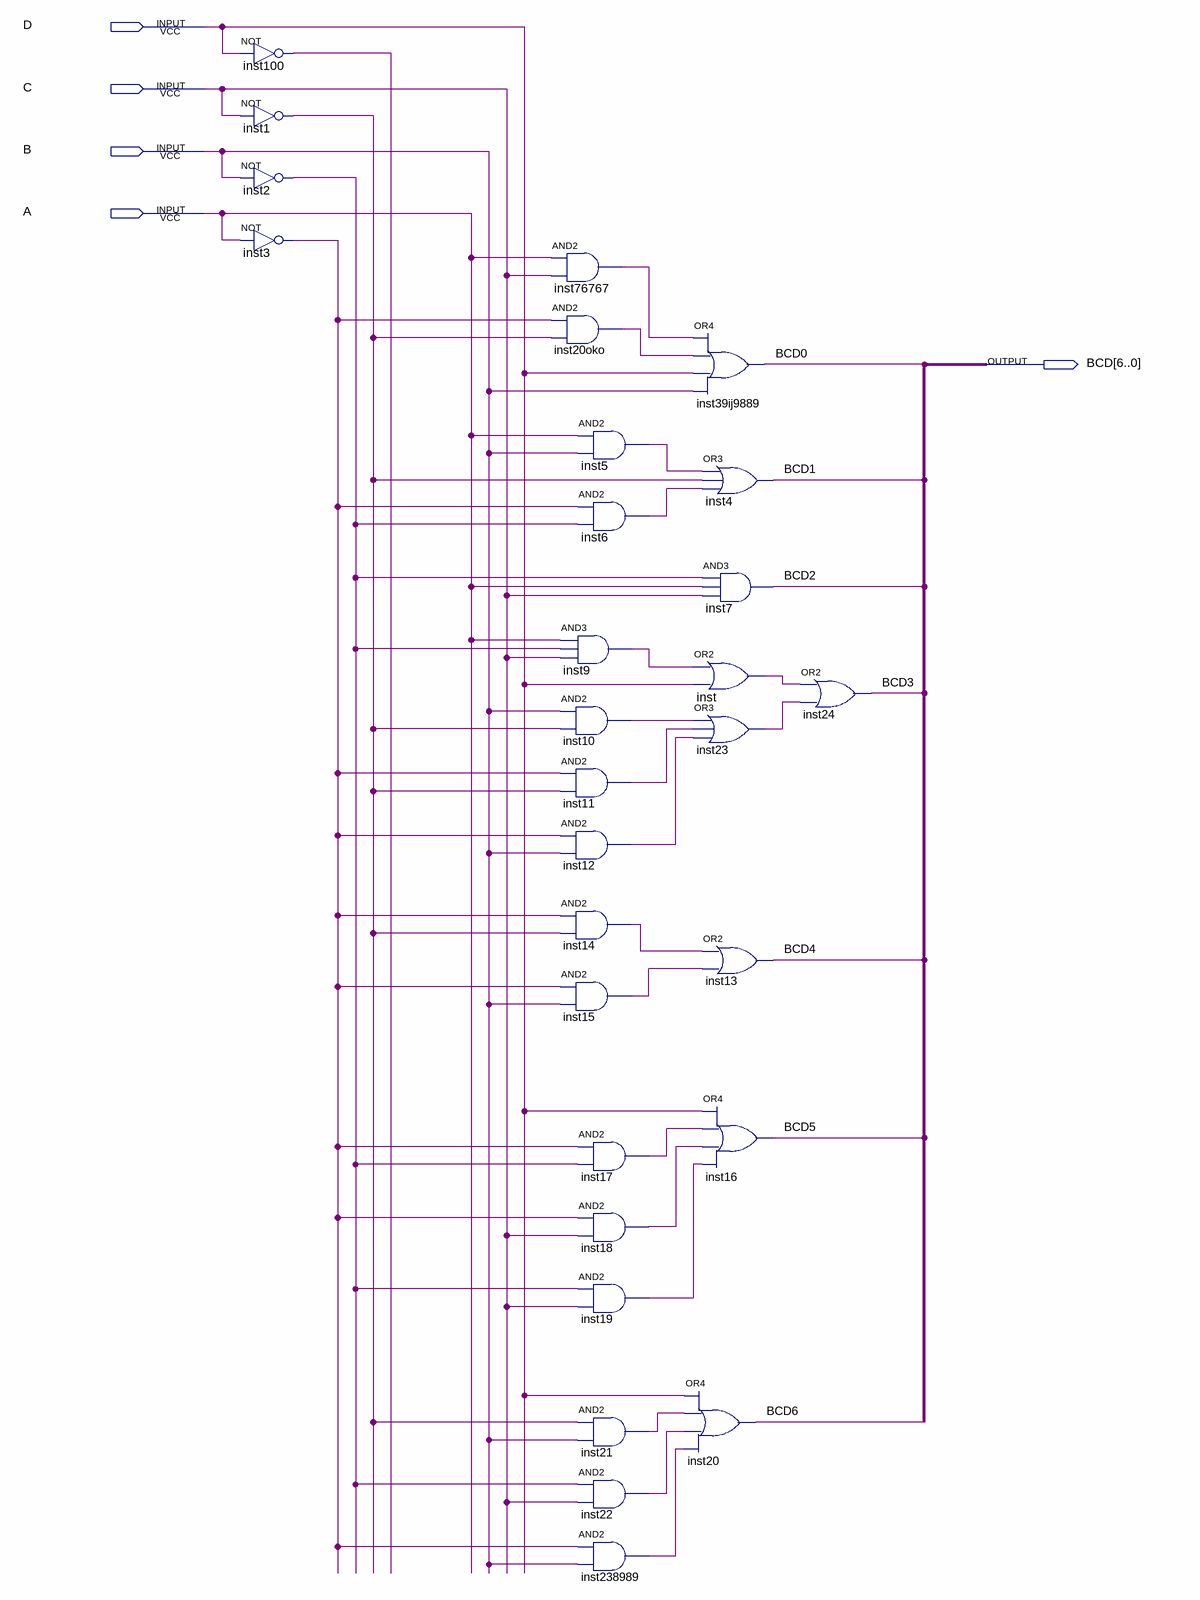
[diagram p0: schematic sheet]
// Quartus schematic BCD7segm.bdf as structural Verilog: 29 symbols, 5 pins
module BCD7segm (
  input  D,
  input  C,
  input  B,
  input  A,
  output [6:0] BCD
);

  wire inst1_out, inst2_out, inst3_out, inst5_out, inst6_out, inst9_out, inst10_out, inst11_out, inst12_out,
       inst14_out, inst15_out, inst17_out, inst18_out, inst19_out, inst20oko_out, inst21_out, inst22_out,
       inst23_out, inst100_out, inst76767_out, inst238989_out, inst_out;

  not inst100 (inst100_out, D);
  not inst1 (inst1_out, C);
  not inst2 (inst2_out, B);
  not inst3 (inst3_out, A);
  and inst76767 (inst76767_out, A, C);
  and inst20oko (inst20oko_out, inst3_out, inst1_out);
  and inst5 (inst5_out, A, B);
  and inst6 (inst6_out, inst3_out, inst2_out);
  and inst9 (inst9_out, A, inst2_out, C);
  and inst10 (inst10_out, B, inst1_out);
  and inst11 (inst11_out, inst3_out, inst1_out);
  and inst12 (inst12_out, inst3_out, B);
  and inst14 (inst14_out, inst3_out, inst1_out);
  and inst15 (inst15_out, inst3_out, B);
  and inst17 (inst17_out, inst3_out, inst2_out);
  and inst18 (inst18_out, inst3_out, C);
  and inst19 (inst19_out, inst2_out, C);
  and inst21 (inst21_out, inst1_out, B);
  and inst22 (inst22_out, inst2_out, C);
  and inst238989 (inst238989_out, inst3_out, B);
  or inst39ij9889 (BCD[0], inst76767_out, inst20oko_out, D, B);
  or inst4 (BCD[1], inst5_out, inst1_out, inst6_out);
  and inst7 (BCD[2], inst2_out, A, C);
  or inst (inst_out, inst9_out, D);
  or inst23 (inst23_out, inst10_out, inst11_out, inst12_out);
  or inst13 (BCD[4], inst14_out, inst15_out);
  or inst16 (BCD[5], D, inst17_out, inst18_out, inst19_out);
  or inst20 (BCD[6], D, inst21_out, inst22_out, inst238989_out);
  or inst24 (BCD[3], inst_out, inst23_out);
endmodule
